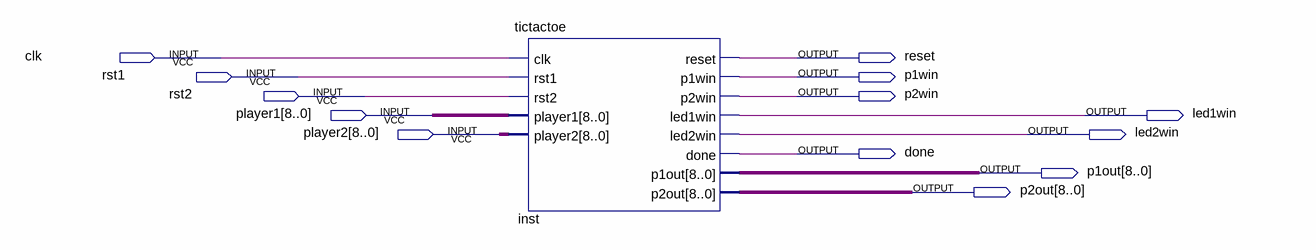
[diagram p0: schematic sheet]
// Quartus schematic FinalTicTacToe.bdf as structural Verilog: 1 symbols, 13 pins
module FinalTicTacToe (
  input  clk,
  input  rst1,
  input  rst2,
  input  [8:0] player1,
  input  [8:0] player2,
  output reset,
  output p1win,
  output p2win,
  output led1win,
  output led2win,
  output done,
  output [8:0] p1out,
  output [8:0] p2out
);

  tictactoe inst (
    .clk(clk), .rst1(rst1), .rst2(rst2), .player1(player1), .player2(player2), .reset(reset), .p1win(p1win),
    .p2win(p2win), .led1win(led1win), .led2win(led2win), .done(done), .p1out(p1out), .p2out(p2out));
endmodule
